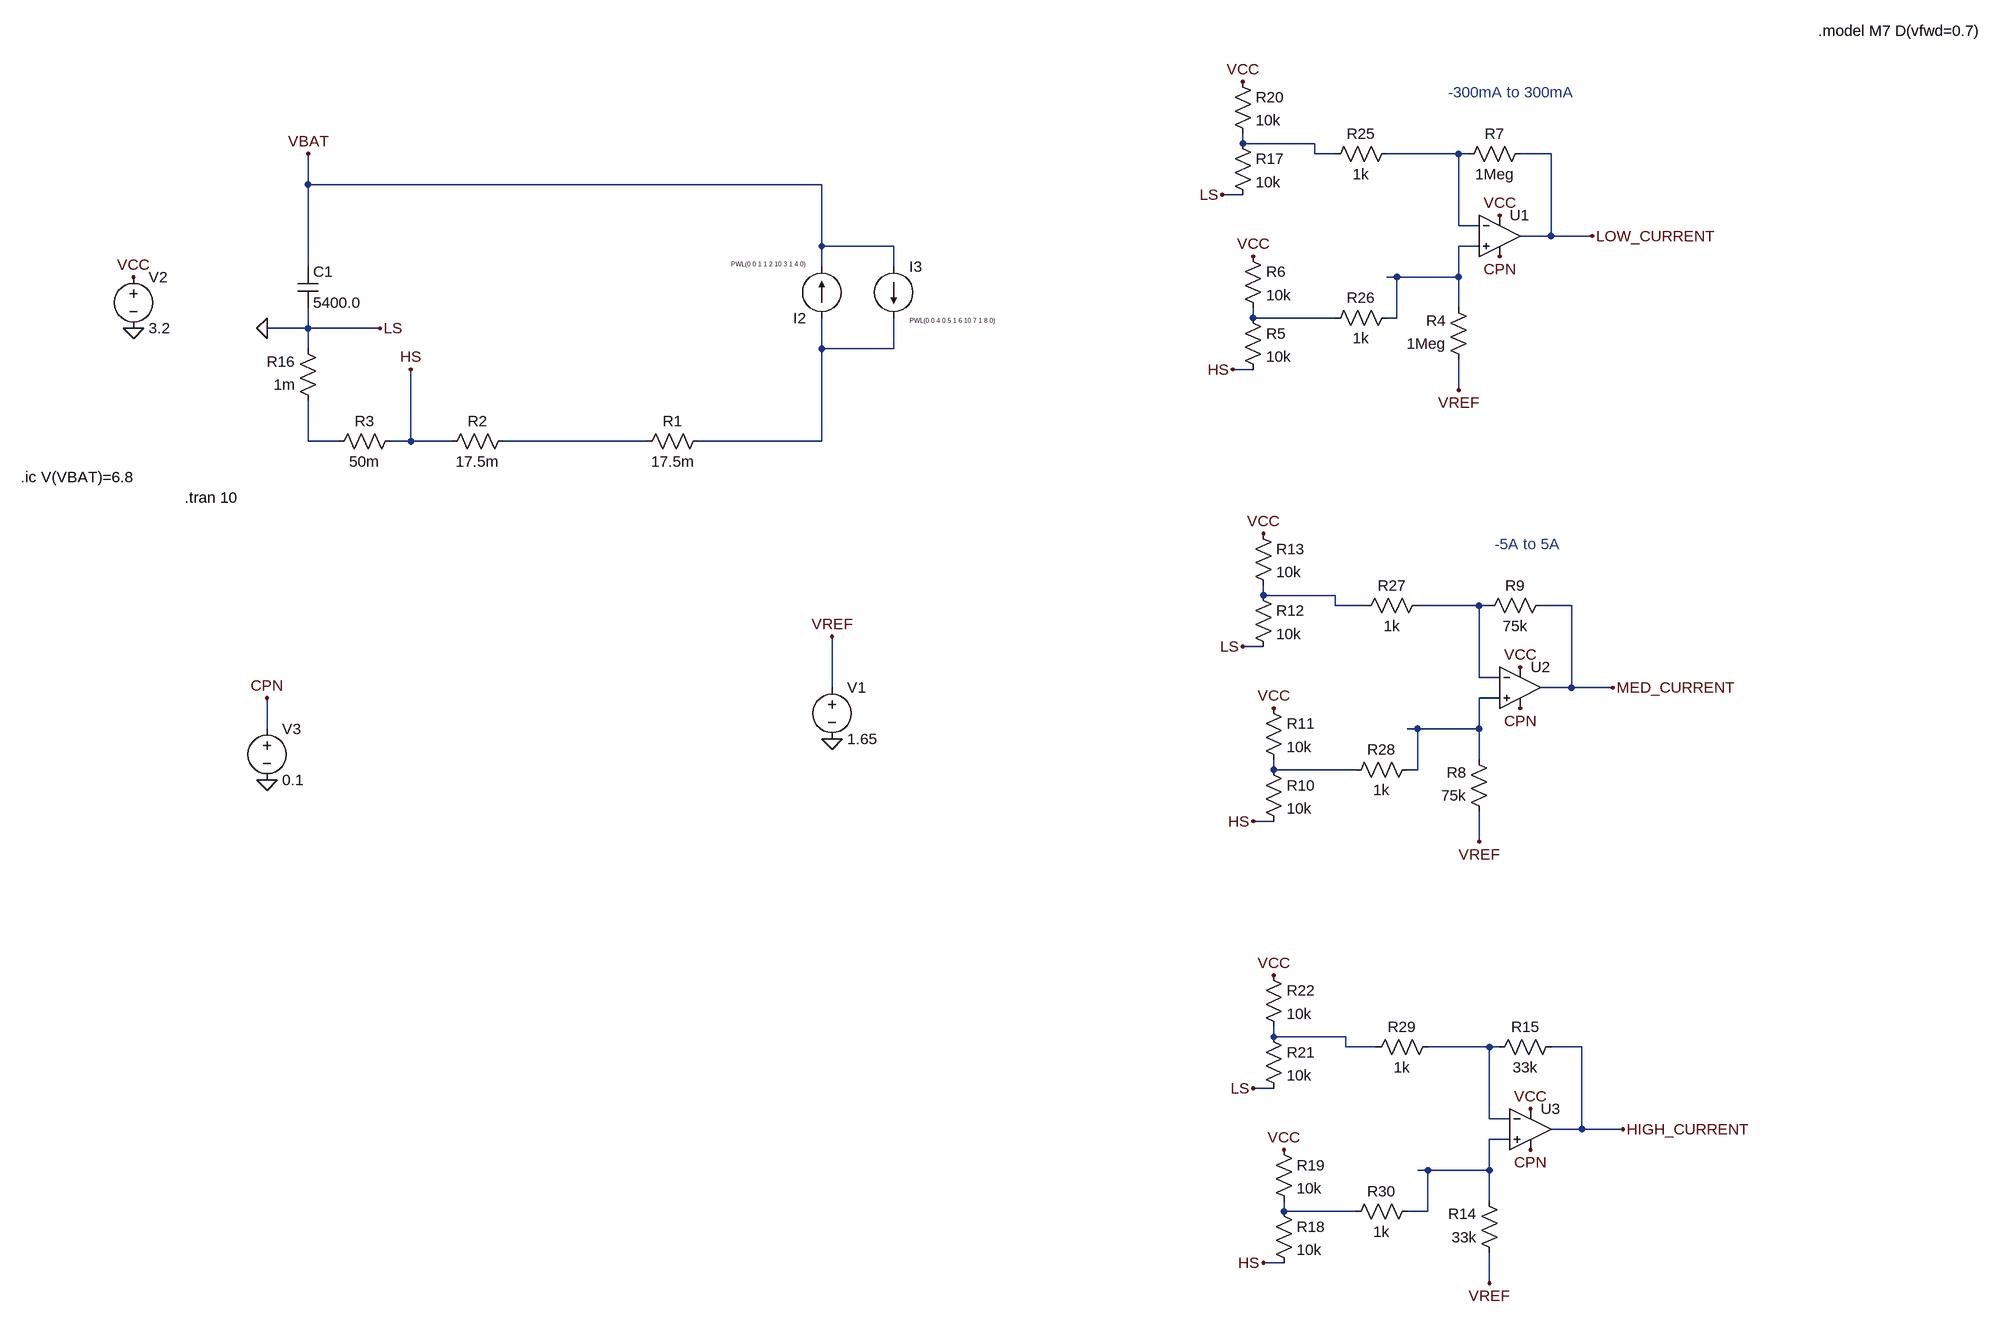
[diagram p0: schematic bms_sim.asc]
bms_sim.asc, the LTspice schematic file:
Version 4
SHEET 1 4480 2360
WIRE 1248 -32 1248 -48
WIRE 1360 -32 1248 -32
WIRE 1360 -16 1360 -32
WIRE 1392 -16 1360 -16
WIRE 1584 -16 1472 -16
WIRE 1600 -16 1584 -16
WIRE 1728 -16 1680 -16
WIRE -208 32 -208 -16
WIRE 592 32 -208 32
WIRE 1248 48 1216 48
WIRE 1584 96 1584 -16
WIRE 1616 96 1584 96
WIRE 1728 112 1728 -16
WIRE 1728 112 1680 112
WIRE 1792 112 1728 112
WIRE 592 128 592 32
WIRE 704 128 592 128
WIRE 1616 128 1584 128
WIRE -208 160 -208 32
WIRE 592 160 592 128
WIRE 704 160 704 128
WIRE 1488 176 1472 176
WIRE 1584 176 1584 128
WIRE 1584 176 1488 176
WIRE 1584 224 1584 176
WIRE 1264 240 1264 224
WIRE 1392 240 1264 240
WIRE 1488 240 1488 176
WIRE 1488 240 1472 240
WIRE -208 256 -208 224
WIRE -208 256 -272 256
WIRE -96 256 -208 256
WIRE -208 288 -208 256
WIRE 592 288 592 240
WIRE 704 288 704 240
WIRE 704 288 592 288
WIRE 1264 320 1232 320
WIRE 1584 352 1584 304
WIRE -208 432 -208 368
WIRE -160 432 -208 432
WIRE -48 432 -48 320
WIRE -48 432 -80 432
WIRE 16 432 -48 432
WIRE 320 432 96 432
WIRE 592 432 592 288
WIRE 592 432 400 432
WIRE 1280 672 1280 656
WIRE 1392 672 1280 672
WIRE 1392 688 1392 672
WIRE 1440 688 1392 688
WIRE 1616 688 1520 688
WIRE 1632 688 1616 688
WIRE 1760 688 1712 688
WIRE 1280 752 1248 752
WIRE 1616 800 1616 688
WIRE 1648 800 1616 800
WIRE 608 816 608 736
WIRE 1760 816 1760 688
WIRE 1760 816 1712 816
WIRE 1824 816 1760 816
WIRE 1648 832 1616 832
WIRE -272 880 -272 832
WIRE 1520 880 1504 880
WIRE 1616 880 1616 832
WIRE 1616 880 1520 880
WIRE 1616 928 1616 880
WIRE 1296 944 1296 928
WIRE 1424 944 1296 944
WIRE 1520 944 1520 880
WIRE 1520 944 1504 944
WIRE 1296 1024 1264 1024
WIRE 1616 1056 1616 1008
WIRE 1296 1360 1296 1344
WIRE 1408 1360 1296 1360
WIRE 1408 1376 1408 1360
WIRE 1456 1376 1408 1376
WIRE 1632 1376 1536 1376
WIRE 1648 1376 1632 1376
WIRE 1776 1376 1728 1376
WIRE 1296 1440 1264 1440
WIRE 1632 1488 1632 1376
WIRE 1664 1488 1632 1488
WIRE 1776 1504 1776 1376
WIRE 1776 1504 1728 1504
WIRE 1840 1504 1776 1504
WIRE 1664 1520 1632 1520
WIRE 1536 1568 1520 1568
WIRE 1632 1568 1632 1520
WIRE 1632 1568 1536 1568
WIRE 1632 1616 1632 1568
WIRE 1312 1632 1312 1616
WIRE 1424 1632 1312 1632
WIRE 1536 1632 1536 1568
WIRE 1536 1632 1504 1632
WIRE 1312 1712 1280 1712
WIRE 1632 1744 1632 1696
FLAG -480 256 0
FLAG -480 176 VCC
FLAG -208 -16 VBAT
FLAG -48 320 HS
FLAG 1232 320 HS
FLAG 1648 80 VCC
FLAG -272 256 0
FLAG -96 256 LS
FLAG 1216 48 LS
FLAG 1648 144 CPN
FLAG -272 832 CPN
FLAG 1584 352 VREF
FLAG 608 736 VREF
FLAG -272 960 0
FLAG 1264 144 VCC
FLAG 1248 -128 VCC
FLAG 1264 1024 HS
FLAG 1680 784 VCC
FLAG 1248 752 LS
FLAG 1680 848 CPN
FLAG 1616 1056 VREF
FLAG 1296 848 VCC
FLAG 1280 576 VCC
FLAG 1280 1712 HS
FLAG 1696 1472 VCC
FLAG 1264 1440 LS
FLAG 1696 1536 CPN
FLAG 1632 1744 VREF
FLAG 1312 1536 VCC
FLAG 1296 1264 VCC
FLAG 1792 112 LOW_CURRENT
FLAG 1824 816 MED_CURRENT
FLAG 1840 1504 HIGH_CURRENT
FLAG 608 896 0
DATAFLAG 1248 -160 ""
DATAFLAG 1264 -144 ""
SYMBOL voltage -480 160 R0
WINDOW 123 0 0 Left 0
WINDOW 39 0 0 Left 0
SYMATTR InstName V2
SYMATTR Value 3.2
SYMBOL res 416 416 R90
WINDOW 0 0 56 VBottom 2
WINDOW 3 32 56 VTop 2
SYMATTR InstName R1
SYMATTR Value 17.5m
SYMBOL res 112 416 R90
WINDOW 0 0 56 VBottom 2
WINDOW 3 32 56 VTop 2
SYMATTR InstName R2
SYMATTR Value 17.5m
SYMBOL OpAmps\\UniversalOpAmp2 1648 112 R0
SYMATTR InstName U1
SYMBOL res 1600 320 R180
WINDOW 0 36 76 Left 2
WINDOW 3 36 40 Left 2
SYMATTR InstName R4
SYMATTR Value 1Meg
SYMBOL res 1696 -32 R90
WINDOW 0 0 56 VBottom 2
WINDOW 3 32 56 VTop 2
SYMATTR InstName R7
SYMATTR Value 1Meg
SYMBOL cap -224 160 R0
SYMATTR InstName C1
SYMATTR Value 5400.0
SYMBOL res -192 384 R180
WINDOW 0 36 76 Left 2
WINDOW 3 36 40 Left 2
SYMATTR InstName R16
SYMATTR Value 1m
SYMBOL voltage -272 864 R0
WINDOW 123 0 0 Left 0
WINDOW 39 0 0 Left 0
SYMATTR InstName V3
SYMATTR Value 0.1
SYMBOL res -64 416 R90
WINDOW 0 0 56 VBottom 2
WINDOW 3 32 56 VTop 2
SYMATTR InstName R3
SYMATTR Value 50m
SYMBOL res 1248 224 R0
SYMATTR InstName R5
SYMATTR Value 10k
SYMBOL res 1248 128 R0
SYMATTR InstName R6
SYMATTR Value 10k
SYMBOL res 1232 -48 R0
SYMATTR InstName R17
SYMATTR Value 10k
SYMBOL res 1232 -144 R0
SYMATTR InstName R20
SYMATTR Value 10k
SYMBOL OpAmps\\UniversalOpAmp2 1680 816 R0
SYMATTR InstName U2
SYMBOL res 1632 1024 R180
WINDOW 0 36 76 Left 2
WINDOW 3 36 40 Left 2
SYMATTR InstName R8
SYMATTR Value 75k
SYMBOL res 1728 672 R90
WINDOW 0 0 56 VBottom 2
WINDOW 3 32 56 VTop 2
SYMATTR InstName R9
SYMATTR Value 75k
SYMBOL res 1280 928 R0
SYMATTR InstName R10
SYMATTR Value 10k
SYMBOL res 1280 832 R0
SYMATTR InstName R11
SYMATTR Value 10k
SYMBOL res 1264 656 R0
SYMATTR InstName R12
SYMATTR Value 10k
SYMBOL res 1264 560 R0
SYMATTR InstName R13
SYMATTR Value 10k
SYMBOL OpAmps\\UniversalOpAmp2 1696 1504 R0
SYMATTR InstName U3
SYMBOL res 1648 1712 R180
WINDOW 0 36 76 Left 2
WINDOW 3 36 40 Left 2
SYMATTR InstName R14
SYMATTR Value 33k
SYMBOL res 1744 1360 R90
WINDOW 0 0 56 VBottom 2
WINDOW 3 32 56 VTop 2
SYMATTR InstName R15
SYMATTR Value 33k
SYMBOL res 1296 1616 R0
SYMATTR InstName R18
SYMATTR Value 10k
SYMBOL res 1296 1520 R0
SYMATTR InstName R19
SYMATTR Value 10k
SYMBOL res 1280 1344 R0
SYMATTR InstName R21
SYMATTR Value 10k
SYMBOL res 1280 1248 R0
SYMATTR InstName R22
SYMATTR Value 10k
SYMBOL load2 592 240 R180
WINDOW 3 25 84 Left 0
WINDOW 123 0 0 Left 0
WINDOW 39 0 0 Left 0
SYMATTR Value PWL(0 0 1 1 2 10 3 1 4 0)
SYMATTR InstName I2
SYMBOL load2 704 160 R0
WINDOW 3 25 84 Left 0
WINDOW 123 0 0 Left 0
WINDOW 39 0 0 Left 0
SYMATTR Value PWL(0 0 4 0 5 1 6 10 7 1 8 0)
SYMATTR InstName I3
SYMBOL res 1488 -32 R90
WINDOW 0 0 56 VBottom 2
WINDOW 3 32 56 VTop 2
SYMATTR InstName R25
SYMATTR Value 1k
SYMBOL res 1488 224 R90
WINDOW 0 0 56 VBottom 2
WINDOW 3 32 56 VTop 2
SYMATTR InstName R26
SYMATTR Value 1k
SYMBOL res 1536 672 R90
WINDOW 0 0 56 VBottom 2
WINDOW 3 32 56 VTop 2
SYMATTR InstName R27
SYMATTR Value 1k
SYMBOL res 1520 928 R90
WINDOW 0 0 56 VBottom 2
WINDOW 3 32 56 VTop 2
SYMATTR InstName R28
SYMATTR Value 1k
SYMBOL res 1552 1360 R90
WINDOW 0 0 56 VBottom 2
WINDOW 3 32 56 VTop 2
SYMATTR InstName R29
SYMATTR Value 1k
SYMBOL res 1520 1616 R90
WINDOW 0 0 56 VBottom 2
WINDOW 3 32 56 VTop 2
SYMATTR InstName R30
SYMATTR Value 1k
SYMBOL voltage 608 800 R0
WINDOW 123 0 0 Left 0
WINDOW 39 0 0 Left 0
SYMATTR InstName V1
SYMATTR Value 1.65
TEXT -400 520 Left 2 !.tran 10
TEXT -656 488 Left 2 !.ic V(VBAT)=6.8
TEXT 2144 -208 Left 2 !.model M7 D(vfwd=0.7)
TEXT 1568 -112 Left 2 ;-300mA to 300mA
TEXT 1640 592 Left 2 ;-5A to 5A

The netlist it stands for:
* bms_sim.asc
V2 VCC 0 3.2
R1 N005 N007 17.5m
R2 N007 HS 17.5m
XU1 N003 N002 VCC CPN LOW_CURRENT level2 Avol=1Meg GBW=10Meg Slew=10Meg Ilimit=25m Rail=0 Vos=0 En=0 Enk=0 In=0 Ink=0 Rin=500Meg  ; pins In+ In- V+ V- OUT
R4 VREF N003 1Meg
R7 LOW_CURRENT N002 1Meg
C1 VBAT 0 5400.0
R16 N006 0 1m
V3 CPN 0 0.1
R3 HS N006 50m
R5 N004 HS 10k
R6 VCC N004 10k
R17 N001 0 10k
R20 VCC N001 10k
XU2 N010 N009 VCC CPN MED_CURRENT level2 Avol=1Meg GBW=10Meg Slew=10Meg Ilimit=25m Rail=0 Vos=0 En=0 Enk=0 In=0 Ink=0 Rin=500Meg  ; pins In+ In- V+ V- OUT
R8 VREF N010 75k
R9 MED_CURRENT N009 75k
R10 N011 HS 10k
R11 VCC N011 10k
R12 N008 0 10k
R13 VCC N008 10k
XU3 N014 N013 VCC CPN HIGH_CURRENT level2 Avol=1Meg GBW=10Meg Slew=10Meg Ilimit=25m Rail=0 Vos=0 En=0 Enk=0 In=0 Ink=0 Rin=500Meg  ; pins In+ In- V+ V- OUT
R14 VREF N014 33k
R15 HIGH_CURRENT N013 33k
R18 N015 HS 10k
R19 VCC N015 10k
R21 N012 0 10k
R22 VCC N012 10k
I2 N005 VBAT PWL(0 0 1 1 2 10 3 1 4 0)
I3 VBAT N005 PWL(0 0 4 0 5 1 6 10 7 1 8 0)
R25 N002 N001 1k
R26 N003 N004 1k
R27 N009 N008 1k
R28 N010 N011 1k
R29 N013 N012 1k
R30 N014 N015 1k
V1 VREF 0 1.65
.tran 10
.ic V(VBAT)=6.8
.model M7 D(vfwd=0.7)
* -300mA to 300mA
* -5A to 5A
.lib UniversalOpAmp2.lib
.backanno
.end